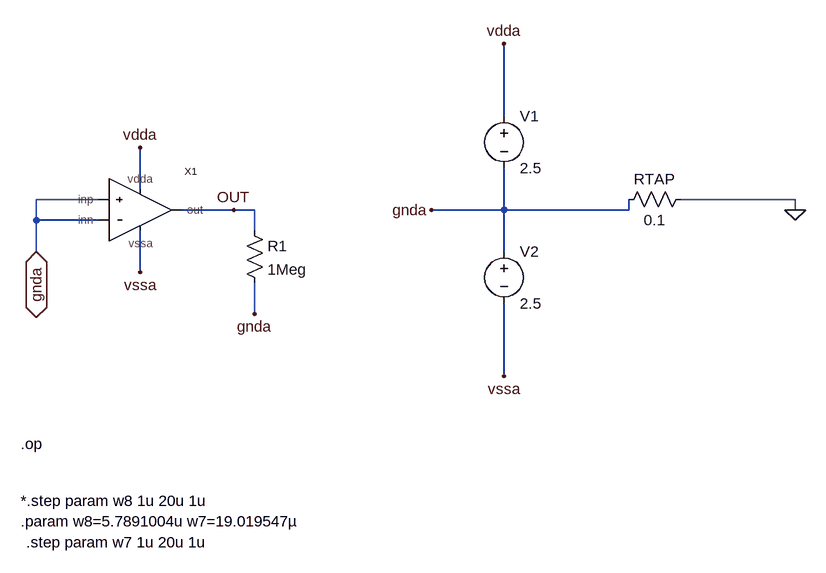
[diagram p0: schematic opamp-top.asc]
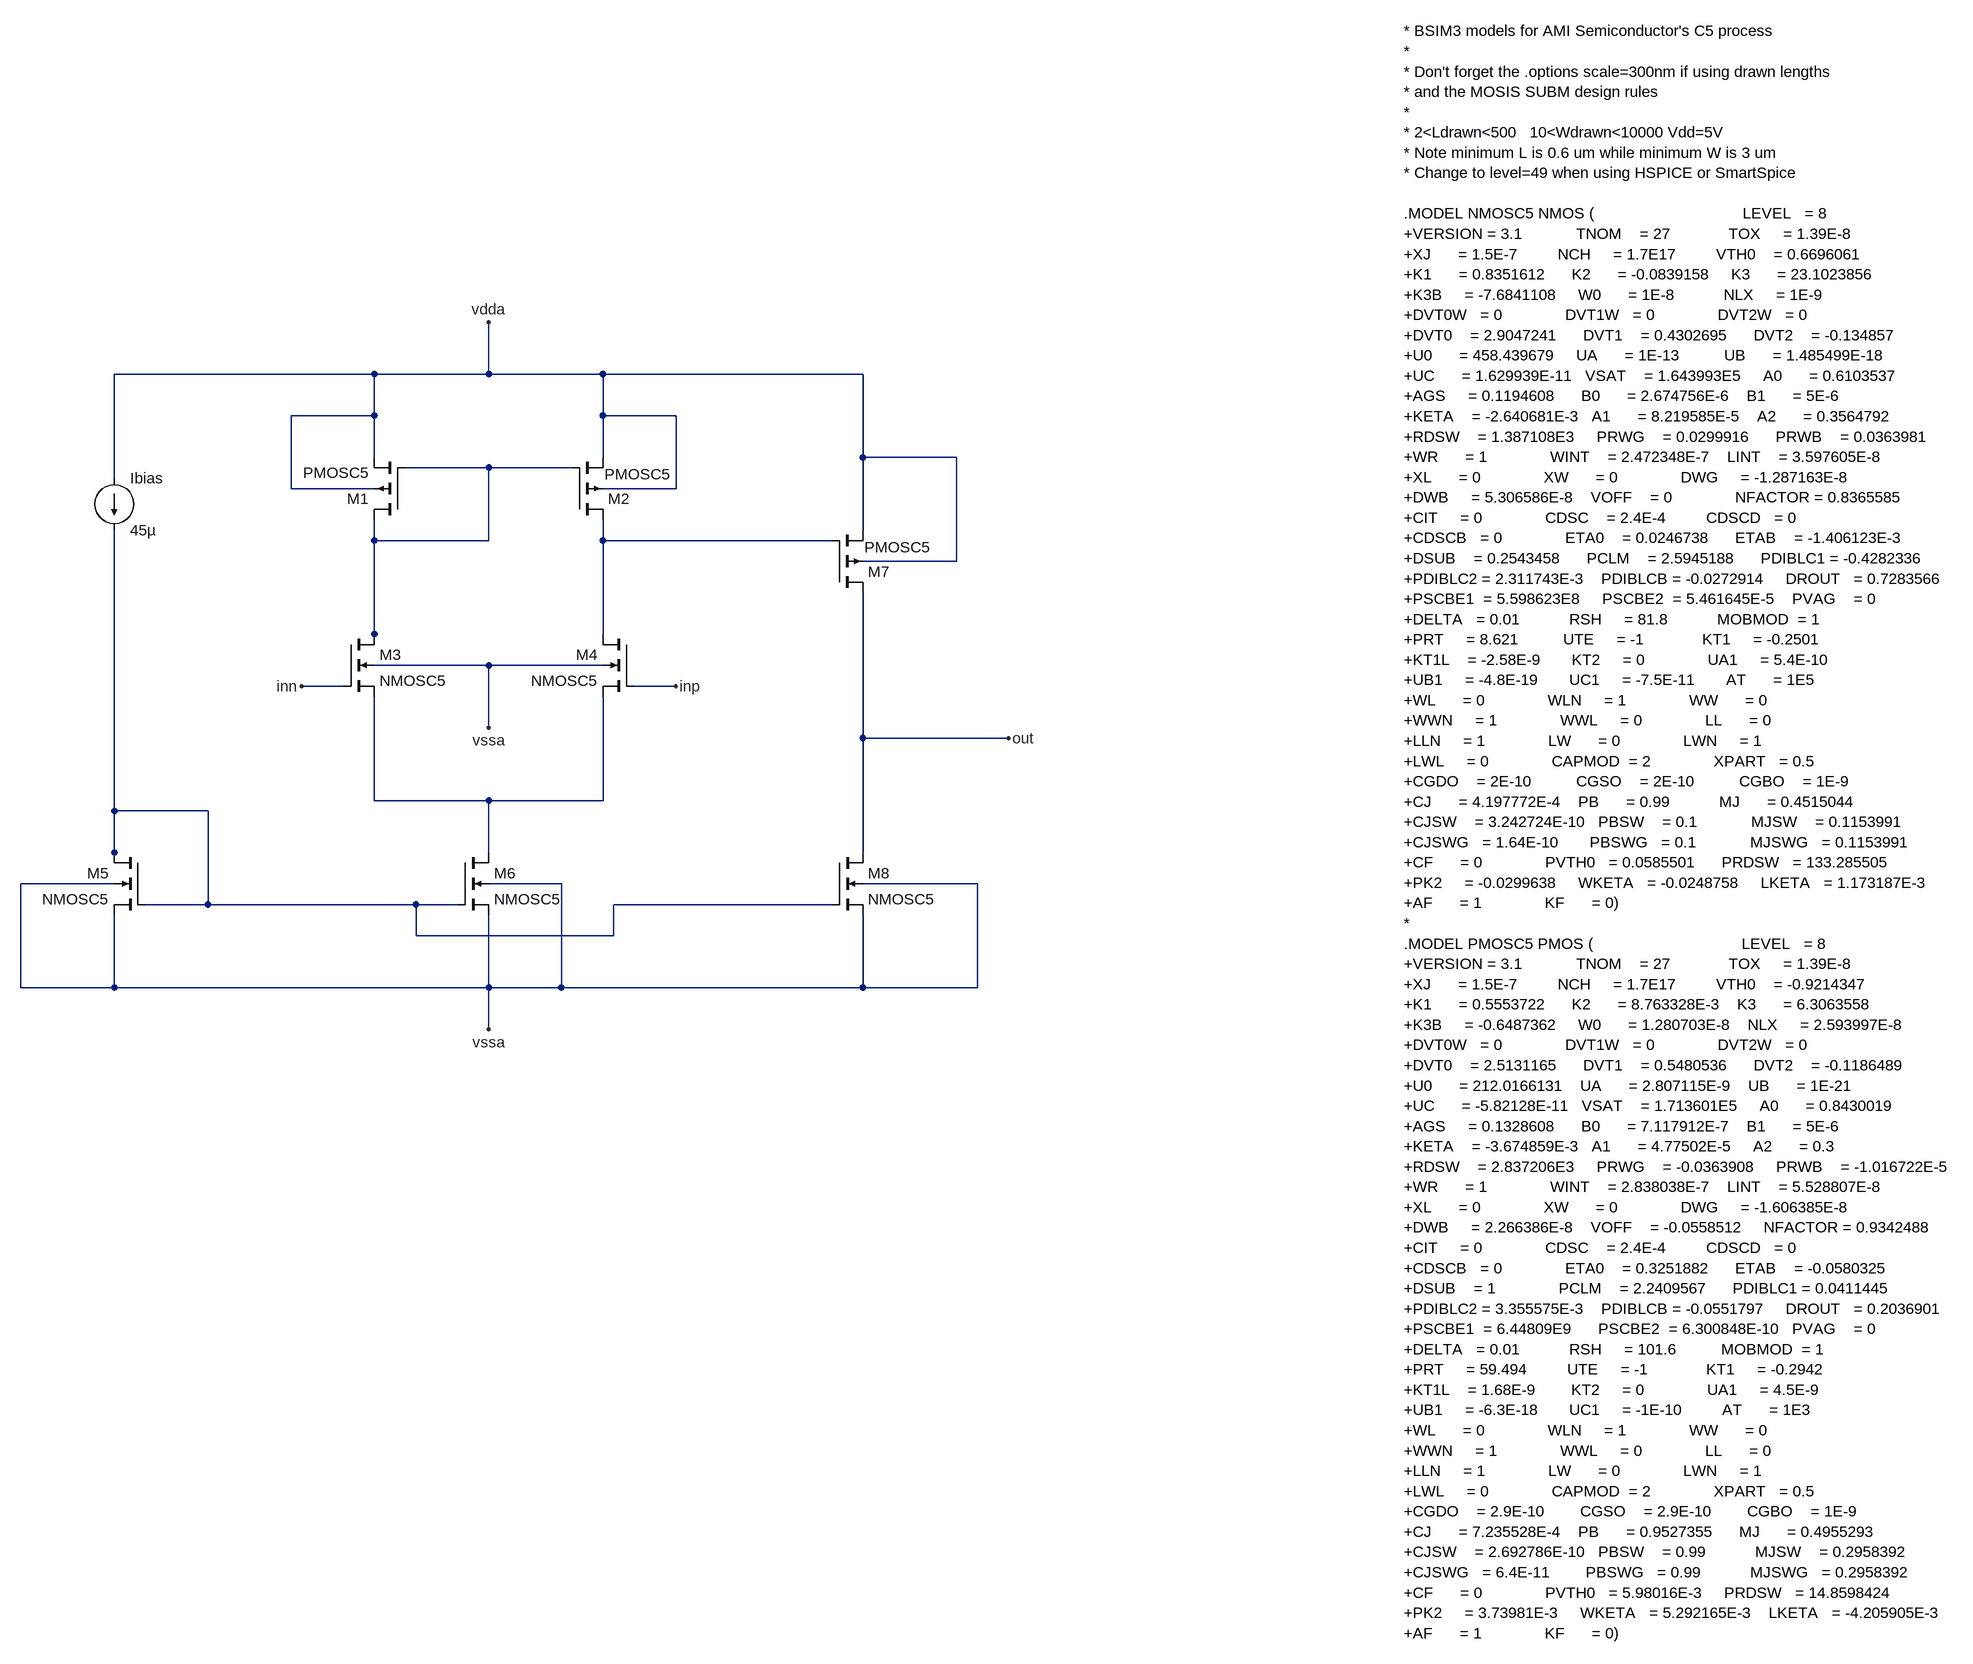
[diagram p1: sub-circuit opamp-schem.asc]
opamp-top.asc, the LTspice schematic file:
Version 4
SHEET 1 1156 688
WIRE 688 16 688 -96
WIRE 128 128 128 64
WIRE 64 144 -32 144
WIRE 1136 144 960 144
WIRE 272 160 192 160
WIRE 304 160 272 160
WIRE 688 160 688 96
WIRE 688 160 576 160
WIRE 880 160 880 144
WIRE 880 160 688 160
WIRE 1136 160 1136 144
WIRE -32 176 -32 144
WIRE 64 176 -32 176
WIRE 304 192 304 160
WIRE -32 224 -32 176
WIRE 688 224 688 160
WIRE 128 256 128 192
WIRE 304 320 304 272
WIRE 688 416 688 304
FLAG 128 64 vdda
FLAG 128 256 vssa
FLAG 304 320 gnda
FLAG 1136 160 0
FLAG 688 -96 vdda
FLAG 576 160 gnda
FLAG 688 416 vssa
FLAG 272 160 OUT
FLAG -32 224 gnda
IOPIN -32 224 BiDir
SYMBOL opamp-schem 112 160 R0
SYMATTR InstName X1
SYMBOL res 288 176 R0
SYMATTR InstName R1
SYMATTR Value 1Meg
SYMBOL voltage 688 0 R0
WINDOW 123 0 0 Left 0
WINDOW 39 0 0 Left 0
SYMATTR InstName V1
SYMATTR Value 2.5
SYMBOL voltage 688 208 R0
WINDOW 123 0 0 Left 0
WINDOW 39 0 0 Left 0
SYMATTR InstName V2
SYMATTR Value 2.5
SYMBOL res 976 128 R90
WINDOW 0 0 56 VBottom 2
WINDOW 3 32 56 VTop 2
SYMATTR InstName RTAP
SYMATTR Value 0.1
TEXT -56 520 Left 2 !.op
TEXT -56 608 Left 2 !*.step param w8 1u 20u 1u\n.param w8=5.7891004u w7=19.019547µ
TEXT -48 672 Left 2 !.step param w7 1u 20u 1u

opamp-schem.asc, the sub-circuit schematic file:
Version 4
SHEET 1 2276 2116
WIRE -208 416 -608 416
WIRE -32 416 -32 336
WIRE -32 416 -208 416
WIRE 144 416 -32 416
WIRE 544 416 144 416
WIRE -208 480 -208 416
WIRE -208 480 -336 480
WIRE 144 480 144 416
WIRE 256 480 144 480
WIRE -208 544 -208 480
WIRE 144 544 144 480
WIRE 544 544 544 416
WIRE 688 544 544 544
WIRE -32 560 -160 560
WIRE 96 560 -32 560
WIRE -608 576 -608 416
WIRE -336 592 -336 480
WIRE -208 592 -336 592
WIRE 256 592 256 480
WIRE 256 592 144 592
WIRE 544 656 544 544
WIRE -208 672 -208 640
WIRE -32 672 -32 560
WIRE -32 672 -208 672
WIRE 144 672 144 640
WIRE 496 672 144 672
WIRE 688 704 688 544
WIRE 688 704 544 704
WIRE -208 816 -208 672
WIRE 144 816 144 672
WIRE -208 832 -208 816
WIRE -32 864 -208 864
WIRE 144 864 -32 864
WIRE -256 896 -320 896
WIRE 256 896 192 896
WIRE -32 960 -32 864
WIRE 544 976 544 752
WIRE 768 976 544 976
WIRE -208 1072 -208 912
WIRE -32 1072 -208 1072
WIRE 144 1072 144 912
WIRE 144 1072 -32 1072
WIRE -608 1088 -608 656
WIRE -464 1088 -608 1088
WIRE -608 1152 -608 1088
WIRE -32 1152 -32 1072
WIRE 544 1152 544 976
WIRE -608 1168 -608 1152
WIRE -608 1200 -752 1200
WIRE 80 1200 -32 1200
WIRE 720 1200 544 1200
WIRE -464 1232 -464 1088
WIRE -464 1232 -560 1232
WIRE -144 1232 -464 1232
WIRE -80 1232 -144 1232
WIRE 496 1232 160 1232
WIRE -144 1280 -144 1232
WIRE 160 1280 160 1232
WIRE 160 1280 -144 1280
WIRE -752 1360 -752 1200
WIRE -608 1360 -608 1248
WIRE -608 1360 -752 1360
WIRE -32 1360 -32 1248
WIRE -32 1360 -608 1360
WIRE 80 1360 80 1200
WIRE 80 1360 -32 1360
WIRE 544 1360 544 1248
WIRE 544 1360 80 1360
WIRE 720 1360 720 1200
WIRE 720 1360 544 1360
WIRE -32 1424 -32 1360
FLAG -320 896 inn
FLAG 256 896 inp
FLAG 768 976 out
FLAG -32 960 vssa
FLAG -32 1424 vssa
FLAG -32 336 vdda
SYMBOL pmos4 -160 640 R180
SYMATTR InstName M1
SYMATTR Value2 l=0.5u w=10u
SYMATTR Value PMOSC5
SYMBOL pmos4 96 640 M180
WINDOW 3 50 70 Left 2
SYMATTR Value PMOSC5
SYMATTR InstName M2
SYMATTR Value2 l=0.5u w=10u
SYMBOL nmos4 -256 816 R0
SYMATTR InstName M3
SYMATTR Value2 l=0.5u w=5u
SYMATTR Value NMOSC5
SYMBOL nmos4 192 816 M0
SYMATTR InstName M4
SYMATTR Value2 l=0.5u w=5u
SYMATTR Value NMOSC5
SYMBOL nmos4 -560 1152 M0
SYMATTR InstName M5
SYMATTR Value2 l=0.5u w=5u
SYMATTR Value NMOSC5
SYMBOL nmos4 -80 1152 R0
SYMATTR InstName M6
SYMATTR Value2 l=0.5u w=5u
SYMATTR Value NMOSC5
SYMBOL nmos4 496 1152 R0
SYMATTR InstName M8
SYMATTR Value2 l=0.5u w=5.81u
SYMATTR Value NMOSC5
SYMBOL pmos4 496 752 M180
WINDOW 3 50 70 Left 2
SYMATTR Value PMOSC5
SYMATTR InstName M7
SYMATTR Value2 l=0.5u w=W7
SYMBOL current -608 576 R0
WINDOW 123 0 0 Left 0
WINDOW 39 0 0 Left 0
SYMATTR InstName Ibias
SYMATTR Value 45µ
TEXT 1376 -112 Left 2 !* BSIM3 models for AMI Semiconductor's C5 process\n*\n* Don't forget the .options scale=300nm if using drawn lengths\n* and the MOSIS SUBM design rules\n*\n* 2<Ldrawn<500   10<Wdrawn<10000 Vdd=5V\n* Note minimum L is 0.6 um while minimum W is 3 um\n* Change to level=49 when using HSPICE or SmartSpice\n \n.MODEL NMOSC5 NMOS (                                 LEVEL   = 8\n+VERSION = 3.1            TNOM    = 27             TOX     = 1.39E-8\n+XJ      = 1.5E-7         NCH     = 1.7E17         VTH0    = 0.6696061\n+K1      = 0.8351612      K2      = -0.0839158     K3      = 23.1023856\n+K3B     = -7.6841108     W0      = 1E-8           NLX     = 1E-9\n+DVT0W   = 0              DVT1W   = 0              DVT2W   = 0\n+DVT0    = 2.9047241      DVT1    = 0.4302695      DVT2    = -0.134857\n+U0      = 458.439679     UA      = 1E-13          UB      = 1.485499E-18\n+UC      = 1.629939E-11   VSAT    = 1.643993E5     A0      = 0.6103537\n+AGS     = 0.1194608      B0      = 2.674756E-6    B1      = 5E-6\n+KETA    = -2.640681E-3   A1      = 8.219585E-5    A2      = 0.3564792\n+RDSW    = 1.387108E3     PRWG    = 0.0299916      PRWB    = 0.0363981\n+WR      = 1              WINT    = 2.472348E-7    LINT    = 3.597605E-8\n+XL      = 0              XW      = 0              DWG     = -1.287163E-8\n+DWB     = 5.306586E-8    VOFF    = 0              NFACTOR = 0.8365585\n+CIT     = 0              CDSC    = 2.4E-4         CDSCD   = 0\n+CDSCB   = 0              ETA0    = 0.0246738      ETAB    = -1.406123E-3\n+DSUB    = 0.2543458      PCLM    = 2.5945188      PDIBLC1 = -0.4282336\n+PDIBLC2 = 2.311743E-3    PDIBLCB = -0.0272914     DROUT   = 0.7283566\n+PSCBE1  = 5.598623E8     PSCBE2  = 5.461645E-5    PVAG    = 0\n+DELTA   = 0.01           RSH     = 81.8           MOBMOD  = 1\n+PRT     = 8.621          UTE     = -1             KT1     = -0.2501\n+KT1L    = -2.58E-9       KT2     = 0              UA1     = 5.4E-10\n+UB1     = -4.8E-19       UC1     = -7.5E-11       AT      = 1E5\n+WL      = 0              WLN     = 1              WW      = 0\n+WWN     = 1              WWL     = 0              LL      = 0\n+LLN     = 1              LW      = 0              LWN     = 1\n+LWL     = 0              CAPMOD  = 2              XPART   = 0.5\n+CGDO    = 2E-10          CGSO    = 2E-10          CGBO    = 1E-9\n+CJ      = 4.197772E-4    PB      = 0.99           MJ      = 0.4515044\n+CJSW    = 3.242724E-10   PBSW    = 0.1            MJSW    = 0.1153991\n+CJSWG   = 1.64E-10       PBSWG   = 0.1            MJSWG   = 0.1153991\n+CF      = 0              PVTH0   = 0.0585501      PRDSW   = 133.285505\n+PK2     = -0.0299638     WKETA   = -0.0248758     LKETA   = 1.173187E-3\n+AF      = 1              KF      = 0)\n*\n.MODEL PMOSC5 PMOS (                                 LEVEL   = 8\n+VERSION = 3.1            TNOM    = 27             TOX     = 1.39E-8\n+XJ      = 1.5E-7         NCH     = 1.7E17         VTH0    = -0.9214347\n+K1      = 0.5553722      K2      = 8.763328E-3    K3      = 6.3063558\n+K3B     = -0.6487362     W0      = 1.280703E-8    NLX     = 2.593997E-8\n+DVT0W   = 0              DVT1W   = 0              DVT2W   = 0\n+DVT0    = 2.5131165      DVT1    = 0.5480536      DVT2    = -0.1186489\n+U0      = 212.0166131    UA      = 2.807115E-9    UB      = 1E-21\n+UC      = -5.82128E-11   VSAT    = 1.713601E5     A0      = 0.8430019\n+AGS     = 0.1328608      B0      = 7.117912E-7    B1      = 5E-6\n+KETA    = -3.674859E-3   A1      = 4.77502E-5     A2      = 0.3\n+RDSW    = 2.837206E3     PRWG    = -0.0363908     PRWB    = -1.016722E-5\n+WR      = 1              WINT    = 2.838038E-7    LINT    = 5.528807E-8\n+XL      = 0              XW      = 0              DWG     = -1.606385E-8\n+DWB     = 2.266386E-8    VOFF    = -0.0558512     NFACTOR = 0.9342488\n+CIT     = 0              CDSC    = 2.4E-4         CDSCD   = 0\n+CDSCB   = 0              ETA0    = 0.3251882      ETAB    = -0.0580325\n+DSUB    = 1              PCLM    = 2.2409567      PDIBLC1 = 0.0411445\n+PDIBLC2 = 3.355575E-3    PDIBLCB = -0.0551797     DROUT   = 0.2036901\n+PSCBE1  = 6.44809E9      PSCBE2  = 6.300848E-10   PVAG    = 0\n+DELTA   = 0.01           RSH     = 101.6          MOBMOD  = 1\n+PRT     = 59.494         UTE     = -1             KT1     = -0.2942\n+KT1L    = 1.68E-9        KT2     = 0              UA1     = 4.5E-9\n+UB1     = -6.3E-18       UC1     = -1E-10         AT      = 1E3\n+WL      = 0              WLN     = 1              WW      = 0\n+WWN     = 1              WWL     = 0              LL      = 0\n+LLN     = 1              LW      = 0              LWN     = 1\n+LWL     = 0              CAPMOD  = 2              XPART   = 0.5\n+CGDO    = 2.9E-10        CGSO    = 2.9E-10        CGBO    = 1E-9\n+CJ      = 7.235528E-4    PB      = 0.9527355      MJ      = 0.4955293\n+CJSW    = 2.692786E-10   PBSW    = 0.99           MJSW    = 0.2958392\n+CJSWG   = 6.4E-11        PBSWG   = 0.99           MJSWG   = 0.2958392\n+CF      = 0              PVTH0   = 5.98016E-3     PRDSW   = 14.8598424\n+PK2     = 3.73981E-3     WKETA   = 5.292165E-3    LKETA   = -4.205905E-3 \n+AF      = 1              KF      = 0)

The netlist it stands for:
* opamp-top.asc
XX1 vdda gnda gnda vssa OUT opamp-schem
R1 OUT gnda 1Meg
V1 vdda gnda 2.5
V2 gnda vssa 2.5
RTAP 0 gnda 0.1

* block symbol definitions
.subckt opamp-schem vdda inn inp vssa out
M1 N001 N001 vdda vdda PMOSC5 l=0.5u w=10u
M2 N002 N001 vdda vdda PMOSC5 l=0.5u w=10u
M3 N001 inn N003 vssa NMOSC5 l=0.5u w=5u
M4 N002 inp N003 vssa NMOSC5 l=0.5u w=5u
M5 N004 N004 vssa vssa NMOSC5 l=0.5u w=5u
M6 N003 N004 vssa vssa NMOSC5 l=0.5u w=5u
M8 out N004 vssa vssa NMOSC5 l=0.5u w=5.81u
M7 out N002 vdda vdda PMOSC5 l=0.5u w=W7
Ibias vdda N004 45µ
* BSIM3 models for AMI Semiconductor's C5 process
*
* Don't forget the .options scale=300nm if using drawn lengths
* and the MOSIS SUBM design rules
*
* 2<Ldrawn<500   10<Wdrawn<10000 Vdd=5V
* Note minimum L is 0.6 um while minimum W is 3 um
* Change to level=49 when using HSPICE or SmartSpice
.MODEL NMOSC5 NMOS (                                 LEVEL   = 8
+VERSION = 3.1            TNOM    = 27             TOX     = 1.39E-8
+XJ      = 1.5E-7         NCH     = 1.7E17         VTH0    = 0.6696061
+K1      = 0.8351612      K2      = -0.0839158     K3      = 23.1023856
+K3B     = -7.6841108     W0      = 1E-8           NLX     = 1E-9
+DVT0W   = 0              DVT1W   = 0              DVT2W   = 0
+DVT0    = 2.9047241      DVT1    = 0.4302695      DVT2    = -0.134857
+U0      = 458.439679     UA      = 1E-13          UB      = 1.485499E-18
+UC      = 1.629939E-11   VSAT    = 1.643993E5     A0      = 0.6103537
+AGS     = 0.1194608      B0      = 2.674756E-6    B1      = 5E-6
+KETA    = -2.640681E-3   A1      = 8.219585E-5    A2      = 0.3564792
+RDSW    = 1.387108E3     PRWG    = 0.0299916      PRWB    = 0.0363981
+WR      = 1              WINT    = 2.472348E-7    LINT    = 3.597605E-8
+XL      = 0              XW      = 0              DWG     = -1.287163E-8
+DWB     = 5.306586E-8    VOFF    = 0              NFACTOR = 0.8365585
+CIT     = 0              CDSC    = 2.4E-4         CDSCD   = 0
+CDSCB   = 0              ETA0    = 0.0246738      ETAB    = -1.406123E-3
+DSUB    = 0.2543458      PCLM    = 2.5945188      PDIBLC1 = -0.4282336
+PDIBLC2 = 2.311743E-3    PDIBLCB = -0.0272914     DROUT   = 0.7283566
+PSCBE1  = 5.598623E8     PSCBE2  = 5.461645E-5    PVAG    = 0
+DELTA   = 0.01           RSH     = 81.8           MOBMOD  = 1
+PRT     = 8.621          UTE     = -1             KT1     = -0.2501
+KT1L    = -2.58E-9       KT2     = 0              UA1     = 5.4E-10
+UB1     = -4.8E-19       UC1     = -7.5E-11       AT      = 1E5
+WL      = 0              WLN     = 1              WW      = 0
+WWN     = 1              WWL     = 0              LL      = 0
+LLN     = 1              LW      = 0              LWN     = 1
+LWL     = 0              CAPMOD  = 2              XPART   = 0.5
+CGDO    = 2E-10          CGSO    = 2E-10          CGBO    = 1E-9
+CJ      = 4.197772E-4    PB      = 0.99           MJ      = 0.4515044
+CJSW    = 3.242724E-10   PBSW    = 0.1            MJSW    = 0.1153991
+CJSWG   = 1.64E-10       PBSWG   = 0.1            MJSWG   = 0.1153991
+CF      = 0              PVTH0   = 0.0585501      PRDSW   = 133.285505
+PK2     = -0.0299638     WKETA   = -0.0248758     LKETA   = 1.173187E-3
+AF      = 1              KF      = 0)
*
.MODEL PMOSC5 PMOS (                                 LEVEL   = 8
+VERSION = 3.1            TNOM    = 27             TOX     = 1.39E-8
+XJ      = 1.5E-7         NCH     = 1.7E17         VTH0    = -0.9214347
+K1      = 0.5553722      K2      = 8.763328E-3    K3      = 6.3063558
+K3B     = -0.6487362     W0      = 1.280703E-8    NLX     = 2.593997E-8
+DVT0W   = 0              DVT1W   = 0              DVT2W   = 0
+DVT0    = 2.5131165      DVT1    = 0.5480536      DVT2    = -0.1186489
+U0      = 212.0166131    UA      = 2.807115E-9    UB      = 1E-21
+UC      = -5.82128E-11   VSAT    = 1.713601E5     A0      = 0.8430019
+AGS     = 0.1328608      B0      = 7.117912E-7    B1      = 5E-6
+KETA    = -3.674859E-3   A1      = 4.77502E-5     A2      = 0.3
+RDSW    = 2.837206E3     PRWG    = -0.0363908     PRWB    = -1.016722E-5
+WR      = 1              WINT    = 2.838038E-7    LINT    = 5.528807E-8
+XL      = 0              XW      = 0              DWG     = -1.606385E-8
+DWB     = 2.266386E-8    VOFF    = -0.0558512     NFACTOR = 0.9342488
+CIT     = 0              CDSC    = 2.4E-4         CDSCD   = 0
+CDSCB   = 0              ETA0    = 0.3251882      ETAB    = -0.0580325
+DSUB    = 1              PCLM    = 2.2409567      PDIBLC1 = 0.0411445
+PDIBLC2 = 3.355575E-3    PDIBLCB = -0.0551797     DROUT   = 0.2036901
+PSCBE1  = 6.44809E9      PSCBE2  = 6.300848E-10   PVAG    = 0
+DELTA   = 0.01           RSH     = 101.6          MOBMOD  = 1
+PRT     = 59.494         UTE     = -1             KT1     = -0.2942
+KT1L    = 1.68E-9        KT2     = 0              UA1     = 4.5E-9
+UB1     = -6.3E-18       UC1     = -1E-10         AT      = 1E3
+WL      = 0              WLN     = 1              WW      = 0
+WWN     = 1              WWL     = 0              LL      = 0
+LLN     = 1              LW      = 0              LWN     = 1
+LWL     = 0              CAPMOD  = 2              XPART   = 0.5
+CGDO    = 2.9E-10        CGSO    = 2.9E-10        CGBO    = 1E-9
+CJ      = 7.235528E-4    PB      = 0.9527355      MJ      = 0.4955293
+CJSW    = 2.692786E-10   PBSW    = 0.99           MJSW    = 0.2958392
+CJSWG   = 6.4E-11        PBSWG   = 0.99           MJSWG   = 0.2958392
+CF      = 0              PVTH0   = 5.98016E-3     PRDSW   = 14.8598424
+PK2     = 3.73981E-3     WKETA   = 5.292165E-3    LKETA   = -4.205905E-3
+AF      = 1              KF      = 0)
.ends opamp-schem

.model NMOS NMOS
.model PMOS PMOS
.lib standard.mos
.op
*.step param w8 1u 20u 1u
.param w8=5.7891004u w7=19.019547µ
.step param w7 1u 20u 1u
.backanno
.end

* Results of the author's LTspice run, read from the files saved beside the schematic
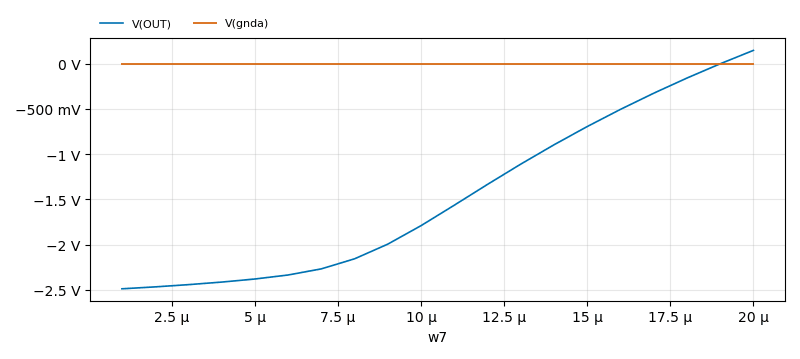
[diagram p2: Operating Point of opamp-top.asc, plotted from the saved traces]
* Operating Point, 1 run:
*   V(OUT): -2.489 V at w7=1 µ, 145.5 mV at w7=20 µ, min -2.489 V, max 145.5 mV
*   V(gnda): 0 V at w7=1 µ, -0.4441 fV at w7=20 µ, min -0.4441 fV, max 0.4441 fV
* From the log:
*   Semiconductor Device Operating Points:
*                           --- BSIM3 MOSFETS ---
*   Name:      m:x1:2      m:x1:1      m:x1:7      m:x1:3      m:x1:4
*   Model:     x1:pmos     x1:pmos     x1:pmos     x1:nmos     x1:nmos
*   Id:       -2.51e-05   -2.51e-05   -9.19e-07    2.51e-05    2.51e-05
*   Vgs:      -1.06e+00   -1.06e+00   -1.06e+00    1.02e+00    1.02e+00
*   Vds:      -1.06e+00   -1.06e+00   -4.99e+00    2.47e+00    2.47e+00
*   Vbs:       0.00e+00    0.00e+00    0.00e+00   -1.48e+00   -1.48e+00
*   Vth:      -8.46e-01   -8.46e-01   -9.23e-01    8.11e-01    8.11e-01
*   Vdsat:    -1.97e-01   -1.97e-01   -1.35e-01    1.65e-01    1.65e-01
*   Gm:        2.20e-04    2.20e-04    1.08e-05    2.94e-04    2.94e-04
*   Gds:       8.17e-06    8.17e-06    2.41e-07    5.85e-06    5.85e-06
*   Gmb        4.72e-05    4.72e-05    2.68e-06    2.74e-05    2.74e-05
*   Cbd:       0.00e+00    0.00e+00    0.00e+00    0.00e+00    0.00e+00
*   Cbs:       0.00e+00    0.00e+00    0.00e+00    0.00e+00    0.00e+00
*   Cgsov:     2.74e-15    2.74e-15    1.25e-16    9.01e-16    9.01e-16
*   Cgdov:     2.74e-15    2.74e-15    1.25e-16    9.01e-16    9.01e-16
*   Cgbov:     3.89e-16    3.89e-16    3.89e-16    4.28e-16    4.28e-16
*   dQgdVgb:   1.32e-14    1.32e-14    9.72e-16    6.06e-15    6.06e-15
*   dQgdVdb:  -2.67e-15   -2.67e-15   -1.23e-16   -8.50e-16   -8.50e-16
*   dQgdVsb:  -9.22e-15   -9.22e-15   -4.21e-16   -3.98e-15   -3.98e-15
*   dQddVgb:  -5.77e-15   -5.77e-15   -2.61e-16   -2.50e-15   -2.50e-15
*   dQddVdb:   2.70e-15    2.70e-15    1.24e-16    8.72e-16    8.72e-16
*   dQddVsb:   3.76e-15    3.76e-15    1.72e-16    1.78e-15    1.78e-15
*   dQbdVgb:  -1.67e-15   -1.67e-15   -4.51e-16   -1.07e-15   -1.07e-15
*   dQbdVdb:   9.93e-18    9.93e-18    4.64e-19    8.20e-18    8.20e-18
*   dQbdVsb:  -1.04e-15   -1.04e-15   -4.81e-17   -4.86e-16   -4.86e-16
*   Name:      m:x1:5      m:x1:6      m:x1:8
*   Model:     x1:nmos     x1:nmos     x1:nmos
*   Id:        4.50e-05    5.01e-05    3.41e-06
*   Vgs:       9.09e-01    9.09e-01    9.09e-01
*   Vds:       9.09e-01    1.48e+00    1.08e-02
*   Vbs:       0.00e+00    0.00e+00    0.00e+00
*   Vth:       6.08e-01    5.99e-01    6.10e-01
*   Vdsat:     2.01e-01    2.07e-01    2.01e-01
*   Gm:        3.35e-04    3.56e-04    1.48e-05
*   Gds:       1.05e-05    8.19e-06    3.10e-04
*   Gmb        7.45e-05    7.88e-05    3.55e-06
*   Cbd:       0.00e+00    0.00e+00    0.00e+00
*   Cbs:       0.00e+00    0.00e+00    0.00e+00
*   Cgsov:     9.01e-16    9.01e-16    1.06e-15
*   Cgdov:     9.01e-16    9.01e-16    1.06e-15
*   Cgbov:     4.28e-16    4.28e-16    4.28e-16
*   dQgdVgb:   6.18e-15    6.18e-15    8.18e-15
*   dQgdVdb:  -8.60e-16   -8.60e-16   -3.41e-15
*   dQgdVsb:  -4.03e-15   -4.03e-15   -3.55e-15
*   dQddVgb:  -2.50e-15   -2.50e-15   -3.86e-15
*   dQddVdb:   8.75e-16    8.74e-16    3.24e-15
*   dQddVsb:   2.03e-15    2.03e-15    1.32e-15
*   dQbdVgb:  -1.18e-15   -1.18e-15   -4.59e-16
*   dQbdVdb:   1.23e-17    1.30e-17   -2.02e-15
*   dQbdVsb:  -9.27e-16   -9.30e-16   -1.63e-16